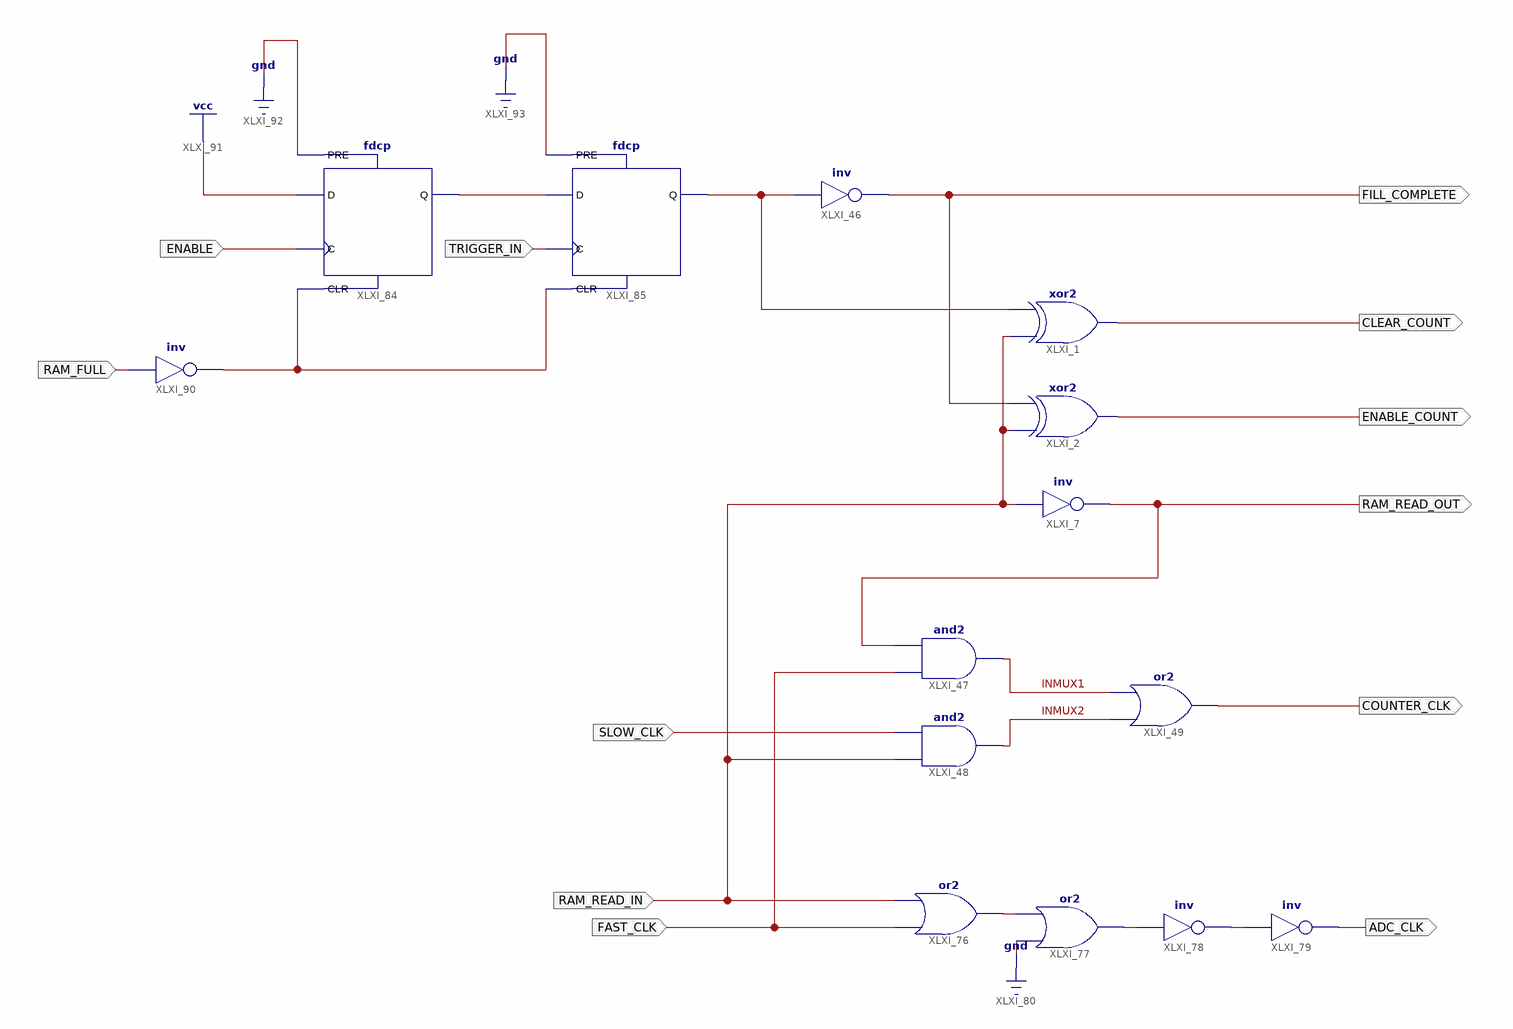
[diagram p0: schematic sheet 1]
// Xilinx ISE schematic ram_read.sch (xc9500xl) as structural Verilog: 14 symbols, 12 ports
module ram_read (
  input  SLOW_CLK,
  input  FAST_CLK,
  input  RAM_READ_IN,
  input  TRIGGER_IN,
  input  ENABLE,
  input  RAM_FULL,
  output RAM_READ_OUT,
  output CLEAR_COUNT,
  output ENABLE_COUNT,
  output FILL_COMPLETE,
  output COUNTER_CLK,
  output ADC_CLK
);

  wire INMUX1, INMUX2, XLXN_119, XLXN_120, XLXN_121, XLXN_138, XLXN_145, XLXN_149;

  xor XLXI_1 (CLEAR_COUNT, RAM_READ_IN, XLXN_149);
  xor XLXI_2 (ENABLE_COUNT, RAM_READ_IN, FILL_COMPLETE);
  not XLXI_7 (RAM_READ_OUT, RAM_READ_IN);
  and XLXI_47 (INMUX1, FAST_CLK, RAM_READ_OUT);
  and XLXI_48 (INMUX2, RAM_READ_IN, SLOW_CLK);
  or XLXI_49 (COUNTER_CLK, INMUX2, INMUX1);
  not XLXI_46 (FILL_COMPLETE, XLXN_149);
  or XLXI_76 (XLXN_119, FAST_CLK, RAM_READ_IN);
  or XLXI_77 (XLXN_120, 1'b0, XLXN_119);
  not XLXI_78 (XLXN_121, XLXN_120);
  not XLXI_79 (ADC_CLK, XLXN_121);
  fdcp XLXI_84 (.C(ENABLE), .CLR(XLXN_145), .D(1'b1), .PRE(1'b0), .Q(XLXN_138));
  not XLXI_90 (XLXN_145, RAM_FULL);
  fdcp XLXI_85 (.C(TRIGGER_IN), .CLR(XLXN_145), .D(XLXN_138), .PRE(1'b0), .Q(XLXN_149));
endmodule
